# Altium schematic sheet MotorDrivers.SchDoc
size A4; SheetNumber: 6; SheetTotal: 7
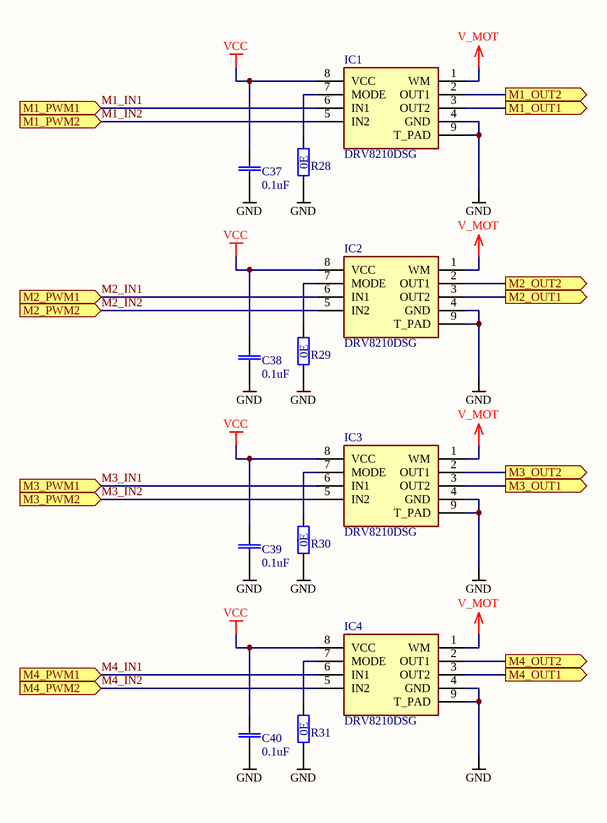
[diagram p0: MotorDrivers.SchDoc]

## Parts
C37  0.1uF  [CAP0402]
C38  0.1uF  [CAP0402]
C39  0.1uF  [CAP0402]
C40  0.1uF  [CAP0402]
IC1  DRV8210DSG  [WSON8(DRV8210)]
IC2  DRV8210DSG  [WSON8(DRV8210)]
IC3  DRV8210DSG  [WSON8(DRV8210)]
IC4  DRV8210DSG  [WSON8(DRV8210)]
R28  0E  [RES0402]  (value not drawn)
R29  0E  [RES0402]  (value not drawn)
R30  0E  [RES0402]  (value not drawn)
R31  0E  [RES0402]  (value not drawn)

## Ports
M1_OUT1 (out), M1_OUT2 (out), M1_PWM1 (in), M1_PWM2 (in), M2_OUT1 (out), M2_OUT2 (out), M2_PWM1 (in), M2_PWM2 (in), M3_OUT1 (out), M3_OUT2 (out), M3_PWM1 (in), M3_PWM2 (in), M4_OUT1 (out), M4_OUT2 (out), M4_PWM1 (in), M4_PWM2 (in)

## Nets
GND: C37.1 C38.1 C39.1 C40.1 IC1.4(GND) IC1.9(T_PAD) IC2.4(GND) IC2.9(T_PAD) IC3.4(GND) IC3.9(T_PAD) IC4.4(GND) IC4.9(T_PAD) R28.1 R29.1 R30.1 R31.1
V_MOT: IC1.1(WM) IC2.1(WM) IC3.1(WM) IC4.1(WM)
VCC: C37.2 C38.2 C39.2 C40.2 IC1.8(VCC) IC2.8(VCC) IC3.8(VCC) IC4.8(VCC)
M1_IN1: IC1.6(IN1) ; port M1_PWM1
M1_IN2: IC1.5(IN2) ; port M1_PWM2
M1_OUT1: IC1.3(OUT2) ; port M1_OUT1
M1_OUT2: IC1.2(OUT1) ; port M1_OUT2
M2_IN1: IC2.6(IN1) ; port M2_PWM1
M2_IN2: IC2.5(IN2) ; port M2_PWM2
M2_OUT1: IC2.3(OUT2) ; port M2_OUT1
M2_OUT2: IC2.2(OUT1) ; port M2_OUT2
M3_IN1: IC3.6(IN1) ; port M3_PWM1
M3_IN2: IC3.5(IN2) ; port M3_PWM2
M3_OUT1: IC3.3(OUT2) ; port M3_OUT1
M3_OUT2: IC3.2(OUT1) ; port M3_OUT2
M4_IN1: IC4.6(IN1) ; port M4_PWM1
M4_IN2: IC4.5(IN2) ; port M4_PWM2
M4_OUT1: IC4.3(OUT2) ; port M4_OUT1
M4_OUT2: IC4.2(OUT1) ; port M4_OUT2
NetIC1_7: IC1.7(MODE) R28.2
NetIC2_7: IC2.7(MODE) R29.2
NetIC3_7: IC3.7(MODE) R30.2
NetIC4_7: IC4.7(MODE) R31.2

## Library data of the parts
C37-C40 = CAP_0402: Manufacturer: Samsung Electro-Mechanics; Manufacturer Partnummber: CL05A104KA5NNNC; Value: 0.1uF
IC1-IC4 = DRV8210DSG: Manufacturer: Texas Instruments; Manufacturer Partnummber: DRV8210DSGR
R28-R31 = RES_0402: Manufacturer: YAGEO; Manufacturer Partnummber: RC0402JR-070RL; Value: 0E